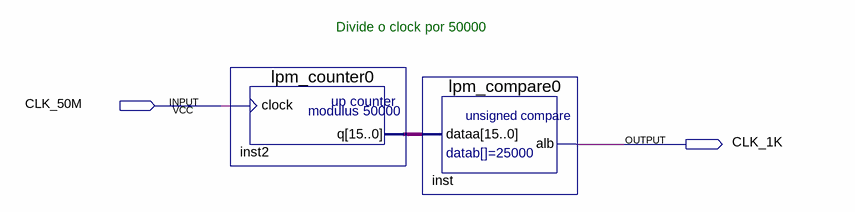
[diagram p0: schematic sheet]
// Quartus schematic divisor_clock.bdf as structural Verilog: 2 symbols, 2 pins
module divisor_clock (
  input  CLK_50M,
  output CLK_1K
);

  wire [15:0] inst2_q;

  lpm_counter0 inst2 (.clock(CLK_50M), .q(inst2_q));
  lpm_compare0 inst (.dataa(inst2_q), .alb(CLK_1K));

  // Notes on the sheet:
  //   Divide o clock por 50000
endmodule
